# EAGLE design transfer-interconnect (EAGLE 7.6.0)

## Sheet 1 of 3
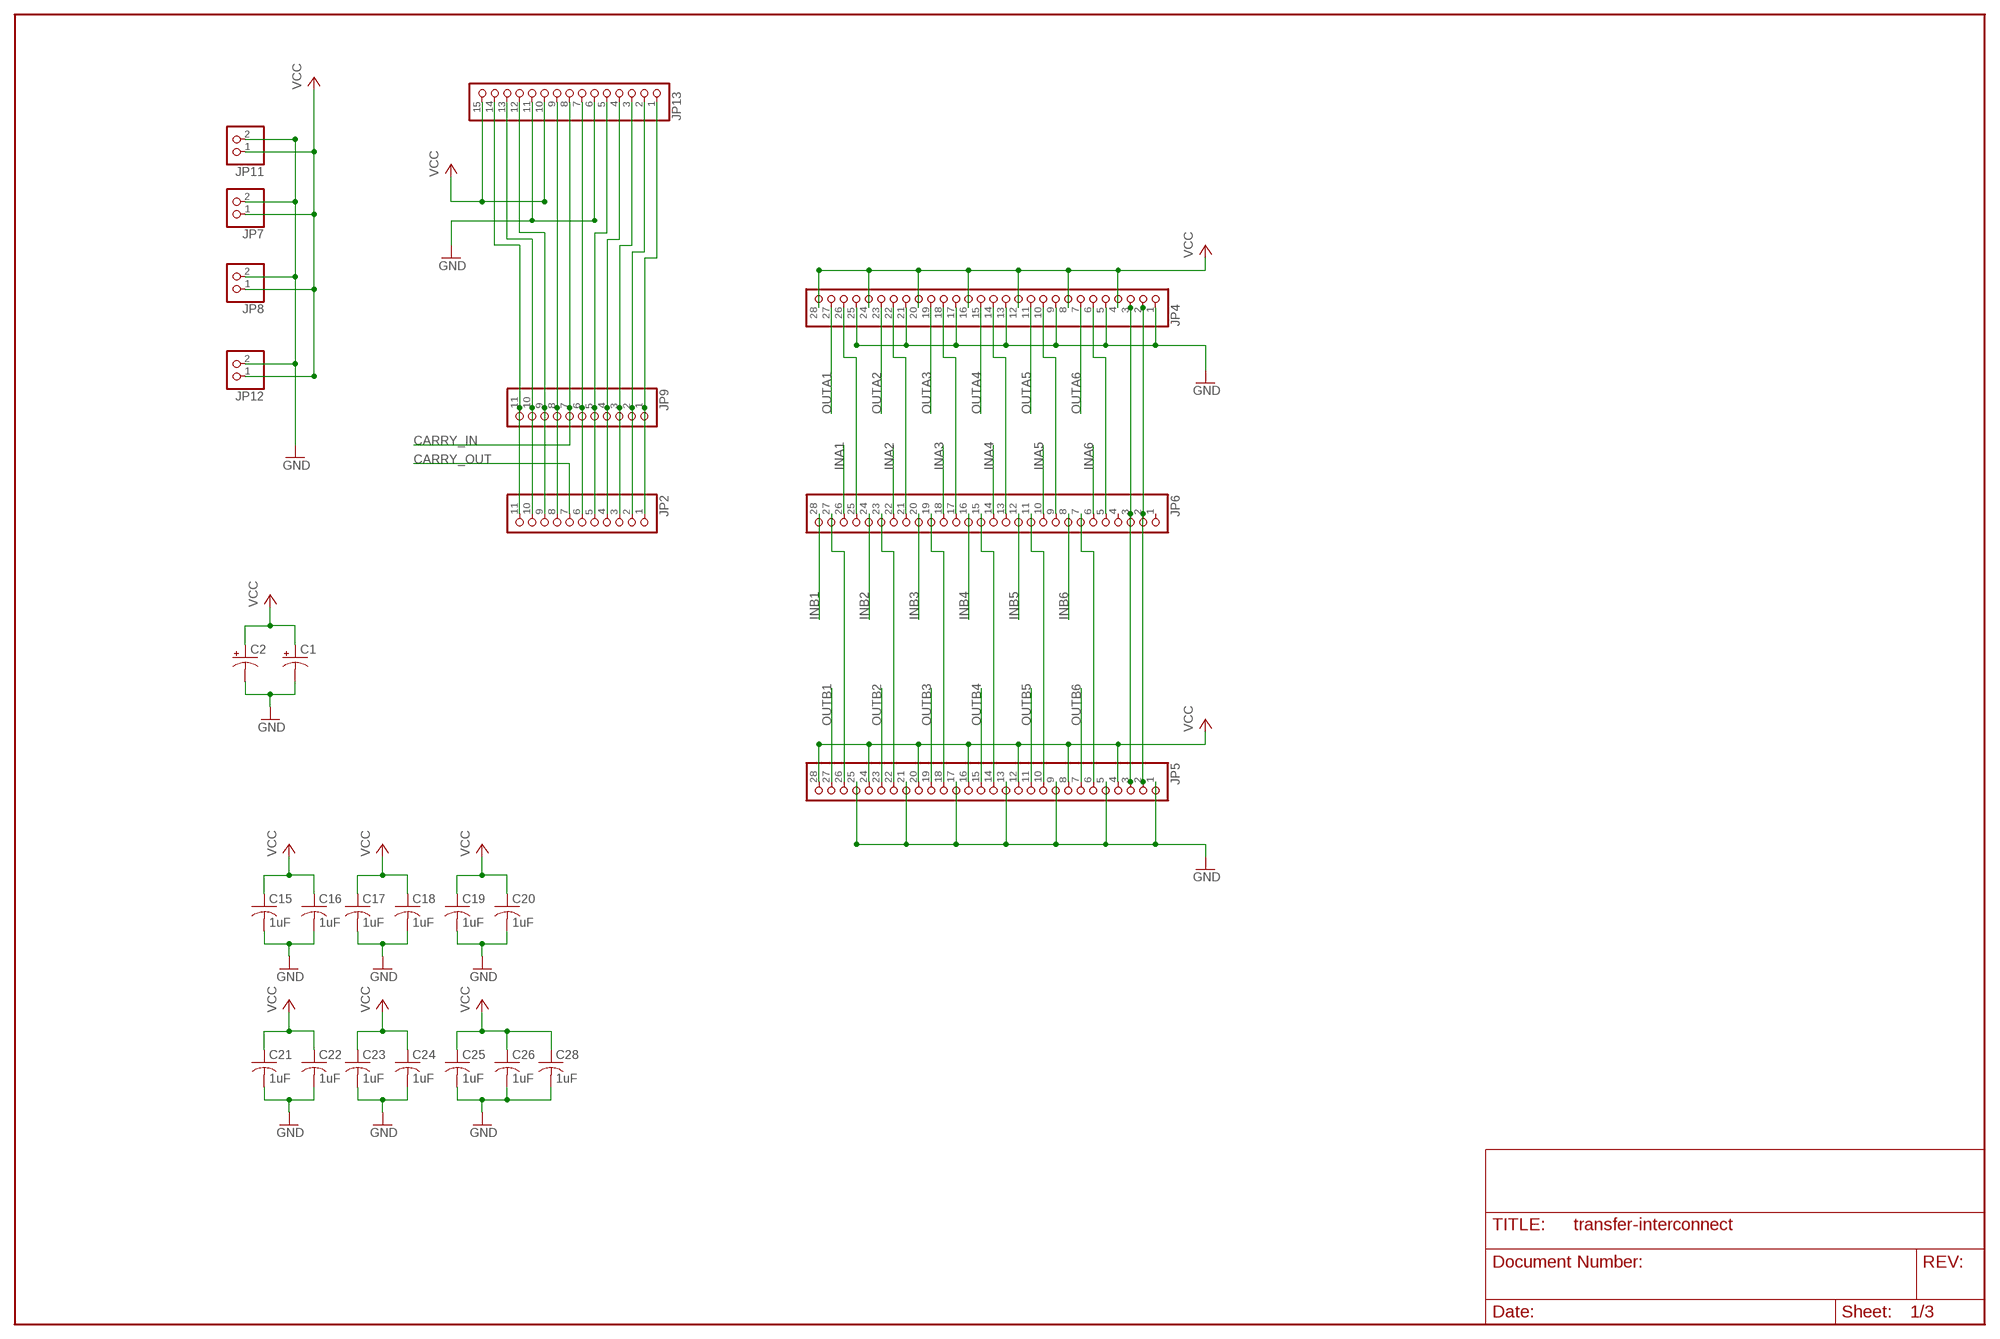
[diagram p0: schematic, sheet 1]

### Parts
C1  CPOL-USE15-6AXIAL  [E15-6]
C2  CPOL-USE15-6AXIAL  [E15-6]
C15  1uF  C-USC0603K  [C0603K]
C16  1uF  C-USC0603K  [C0603K]
C17  1uF  C-USC0603K  [C0603K]
C18  1uF  C-USC0603K  [C0603K]
C19  1uF  C-USC0603K  [C0603K]
C20  1uF  C-USC0603K  [C0603K]
C21  1uF  C-USC0603K  [C0603K]
C22  1uF  C-USC0603K  [C0603K]
C23  1uF  C-USC0603K  [C0603K]
C24  1uF  C-USC0603K  [C0603K]
C25  1uF  C-USC0603K  [C0603K]
C26  1uF  C-USC0603K  [C0603K]
C28  1uF  C-USC0603K  [C0603K]
JP2  PINHD-1X11  [1X11]
JP4  PINHD-1X28  [1X28]
JP5  PINHD-1X28  [1X28]
JP6  PINHD-1X28  [1X28]
JP7  PINHD-1X2  [1X02]
JP8  PINHD-1X2  [1X02]
JP9  PINHD-1X11  [1X11]
JP11  PINHD-1X2  [1X02]
JP12  PINHD-1X2  [1X02]
JP13  PINHD-1X15  [1X15]

### Nets
CARRY_IN: JP9.7 JP13.8 ; also sheet 3
CARRY_OUT: JP2.7 ; also sheet 3
GND: C1.- C2.- C15.2 C16.2 C17.2 C18.2 C19.2 C20.2 C21.2 C22.2 C23.2 C24.2 C25.2 C26.2 C28.2 JP4.1 JP4.5 JP4.9 JP4.13 JP4.17 JP4.21 JP4.25 JP5.1 JP5.5 JP5.9 JP5.13 JP5.17 JP5.21 JP5.25 JP7.2 JP8.2 JP11.2 JP12.2 JP13.6 JP13.11 ; also sheet 2,3
INA1: JP6.26 ; also sheet 2
INA2: JP6.22 ; also sheet 2
INA3: JP6.18 ; also sheet 2
INA4: JP6.14 ; also sheet 2
INA5: JP6.10 ; also sheet 2
INA6: JP6.6 ; also sheet 2
INB1: JP6.28 ; also sheet 3
INB2: JP6.24 ; also sheet 3
INB3: JP6.20 ; also sheet 3
INB4: JP6.16 ; also sheet 3
INB5: JP6.12 ; also sheet 3
INB6: JP6.8 ; also sheet 3
N$1: JP4.3 JP5.3 JP6.3
N$2: JP4.2 JP5.2 JP6.2
N$3: JP4.10 JP6.9
N$4: JP2.8 JP9.8 JP13.9
N$5: JP4.6 JP6.5
N$7: JP4.14 JP6.13
N$8: JP2.6 JP9.6 JP13.7
N$9: JP4.18 JP6.17
N$11: JP4.22 JP6.21
N$13: JP4.26 JP6.25
N$15: JP5.6 JP6.7
N$17: JP5.10 JP6.11
N$19: JP5.14 JP6.15
N$21: JP5.18 JP6.19
N$23: JP5.22 JP6.23
N$25: JP5.26 JP6.27
N$32: JP2.11 JP9.11 JP13.14
N$33: JP2.10 JP9.10 JP13.13
N$34: JP2.9 JP9.9 JP13.12
N$38: JP2.5 JP9.5 JP13.5
N$39: JP2.4 JP9.4 JP13.4
N$40: JP2.3 JP9.3 JP13.3
N$41: JP2.2 JP9.2 JP13.2
N$46: JP2.1 JP9.1 JP13.1
OUTA1: JP4.27 ; also sheet 2
OUTA2: JP4.23 ; also sheet 2
OUTA3: JP4.19 ; also sheet 2
OUTA4: JP4.15 ; also sheet 2
OUTA5: JP4.11 ; also sheet 2
OUTA6: JP4.7 ; also sheet 2
OUTB1: JP5.27 ; also sheet 3
OUTB2: JP5.23 ; also sheet 3
OUTB3: JP5.19 ; also sheet 3
OUTB4: JP5.15 ; also sheet 3
OUTB5: JP5.11 ; also sheet 3
OUTB6: JP5.7 ; also sheet 3
VCC: C1.+ C2.+ C15.1 C16.1 C17.1 C18.1 C19.1 C20.1 C21.1 C22.1 C23.1 C24.1 C25.1 C26.1 C28.1 JP4.4 JP4.8 JP4.12 JP4.16 JP4.20 JP4.24 JP4.28 JP5.4 JP5.8 JP5.12 JP5.16 JP5.20 JP5.24 JP5.28 JP7.1 JP8.1 JP11.1 JP12.1 JP13.10 JP13.15 ; also sheet 2,3
Unconnected: JP6.1 JP6.4

## Sheet 2 of 3
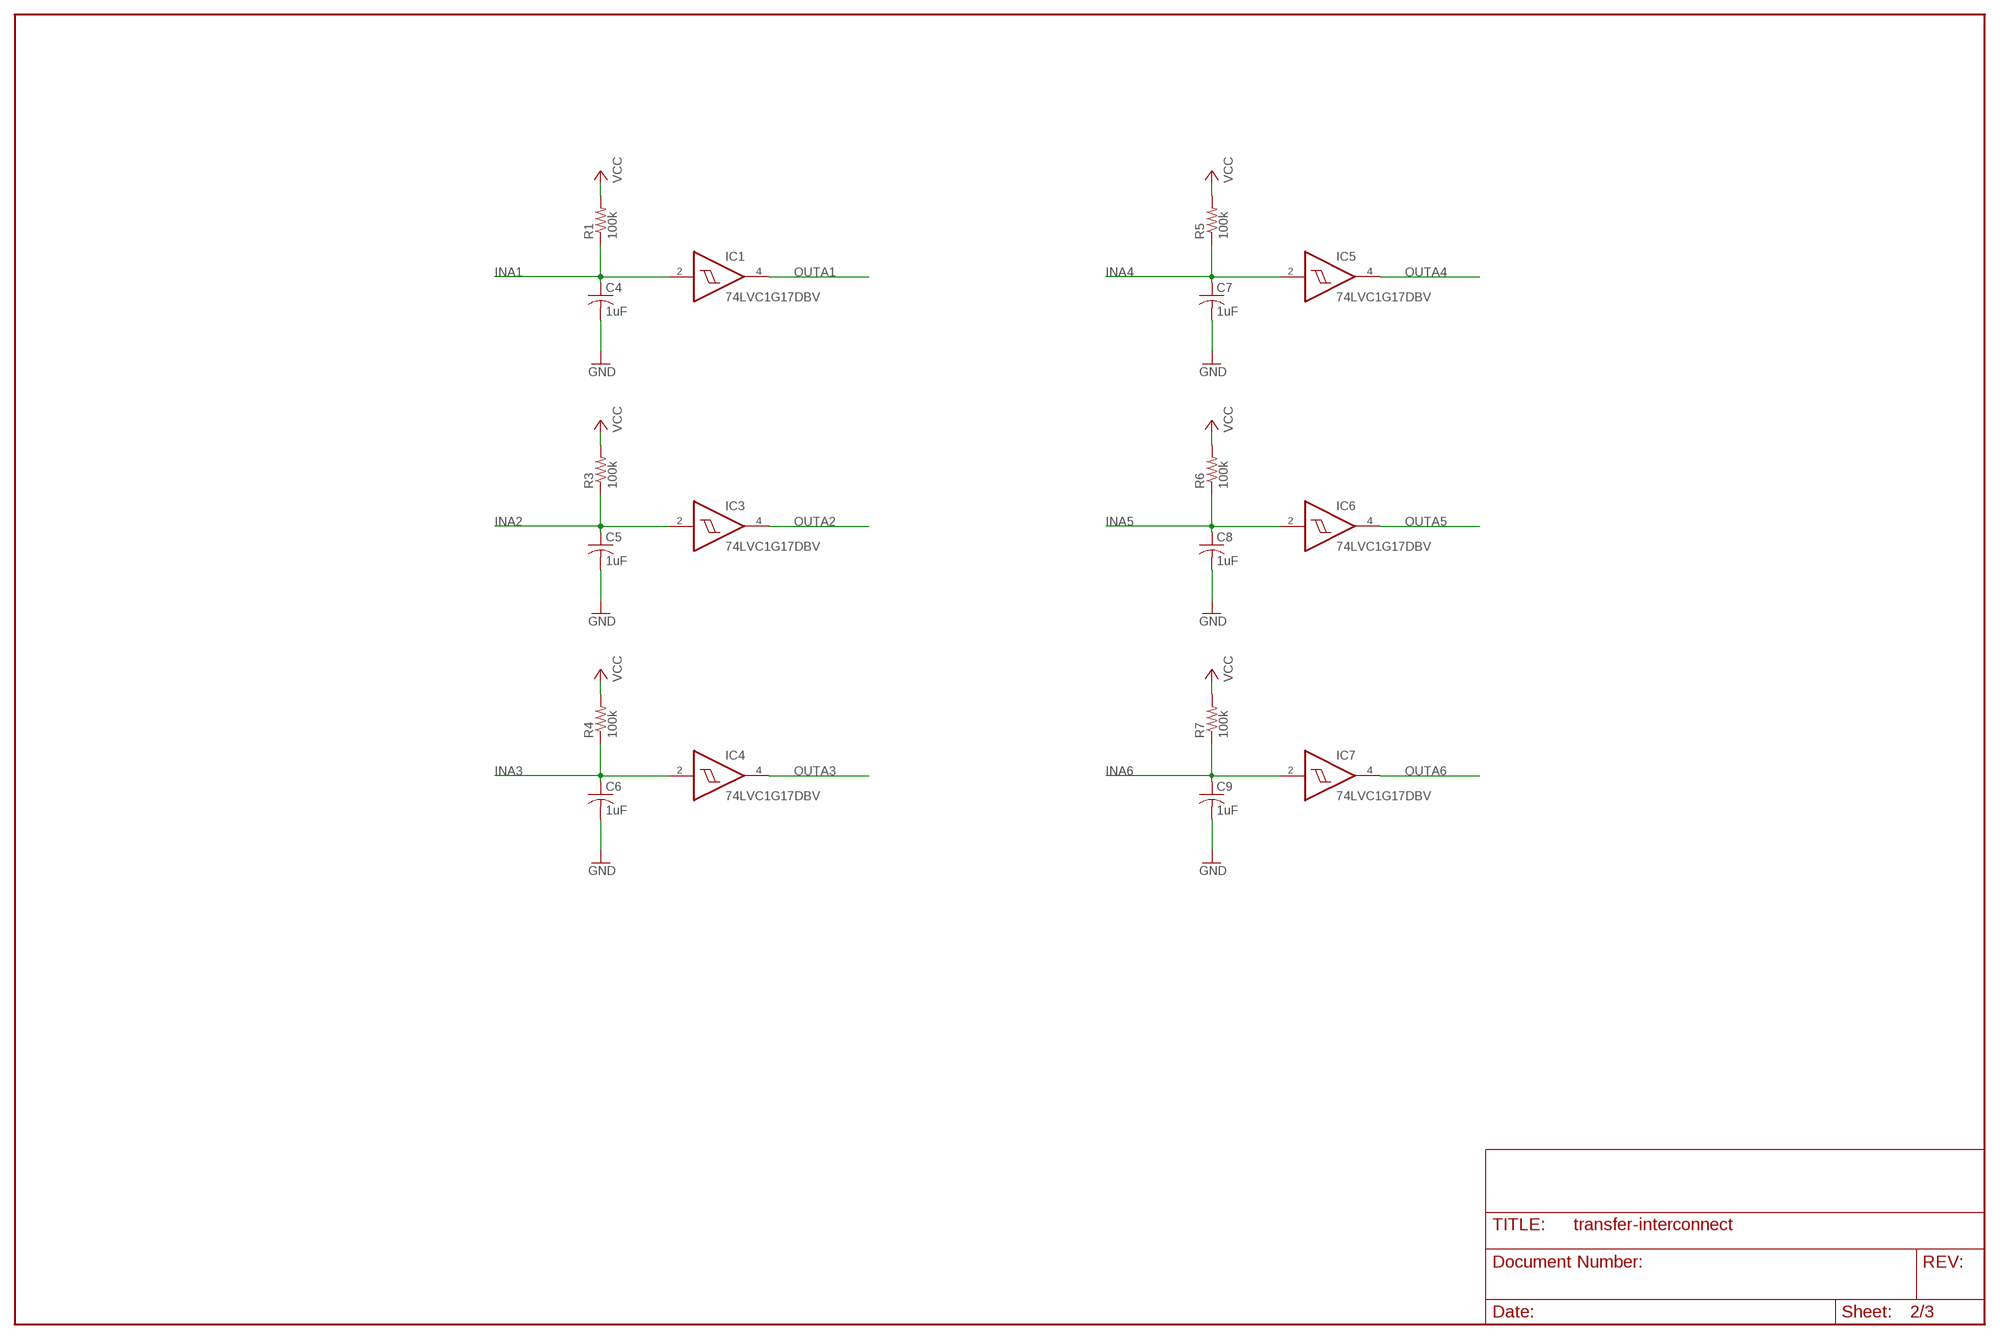
[diagram p1: schematic, sheet 2]

### Parts
C4  1uF  C-USC0603K  [C0603K]
C5  1uF  C-USC0603K  [C0603K]
C6  1uF  C-USC0603K  [C0603K]
C7  1uF  C-USC0603K  [C0603K]
C8  1uF  C-USC0603K  [C0603K]
C9  1uF  C-USC0603K  [C0603K]
IC1  74LVC1G17DBV  [SOT23-5]
IC3  74LVC1G17DBV  [SOT23-5]
IC4  74LVC1G17DBV  [SOT23-5]
IC5  74LVC1G17DBV  [SOT23-5]
IC6  74LVC1G17DBV  [SOT23-5]
IC7  74LVC1G17DBV  [SOT23-5]
R1  100k  R-US_R0603  [R0603]
R3  100k  R-US_R0603  [R0603]
R4  100k  R-US_R0603  [R0603]
R5  100k  R-US_R0603  [R0603]
R6  100k  R-US_R0603  [R0603]
R7  100k  R-US_R0603  [R0603]

### Nets
GND: C4.2 C5.2 C6.2 C7.2 C8.2 C9.2 ; also sheet 1,3
INA1: C4.1 IC1.2(I) R1.1 ; also sheet 1
INA2: C5.1 IC3.2(I) R3.1 ; also sheet 1
INA3: C6.1 IC4.2(I) R4.1 ; also sheet 1
INA4: C7.1 IC5.2(I) R5.1 ; also sheet 1
INA5: C8.1 IC6.2(I) R6.1 ; also sheet 1
INA6: C9.1 IC7.2(I) R7.1 ; also sheet 1
OUTA1: IC1.4(O) ; also sheet 1
OUTA2: IC3.4(O) ; also sheet 1
OUTA3: IC4.4(O) ; also sheet 1
OUTA4: IC5.4(O) ; also sheet 1
OUTA5: IC6.4(O) ; also sheet 1
OUTA6: IC7.4(O) ; also sheet 1
VCC: R1.2 R3.2 R4.2 R5.2 R6.2 R7.2 ; also sheet 1,3

## Sheet 3 of 3
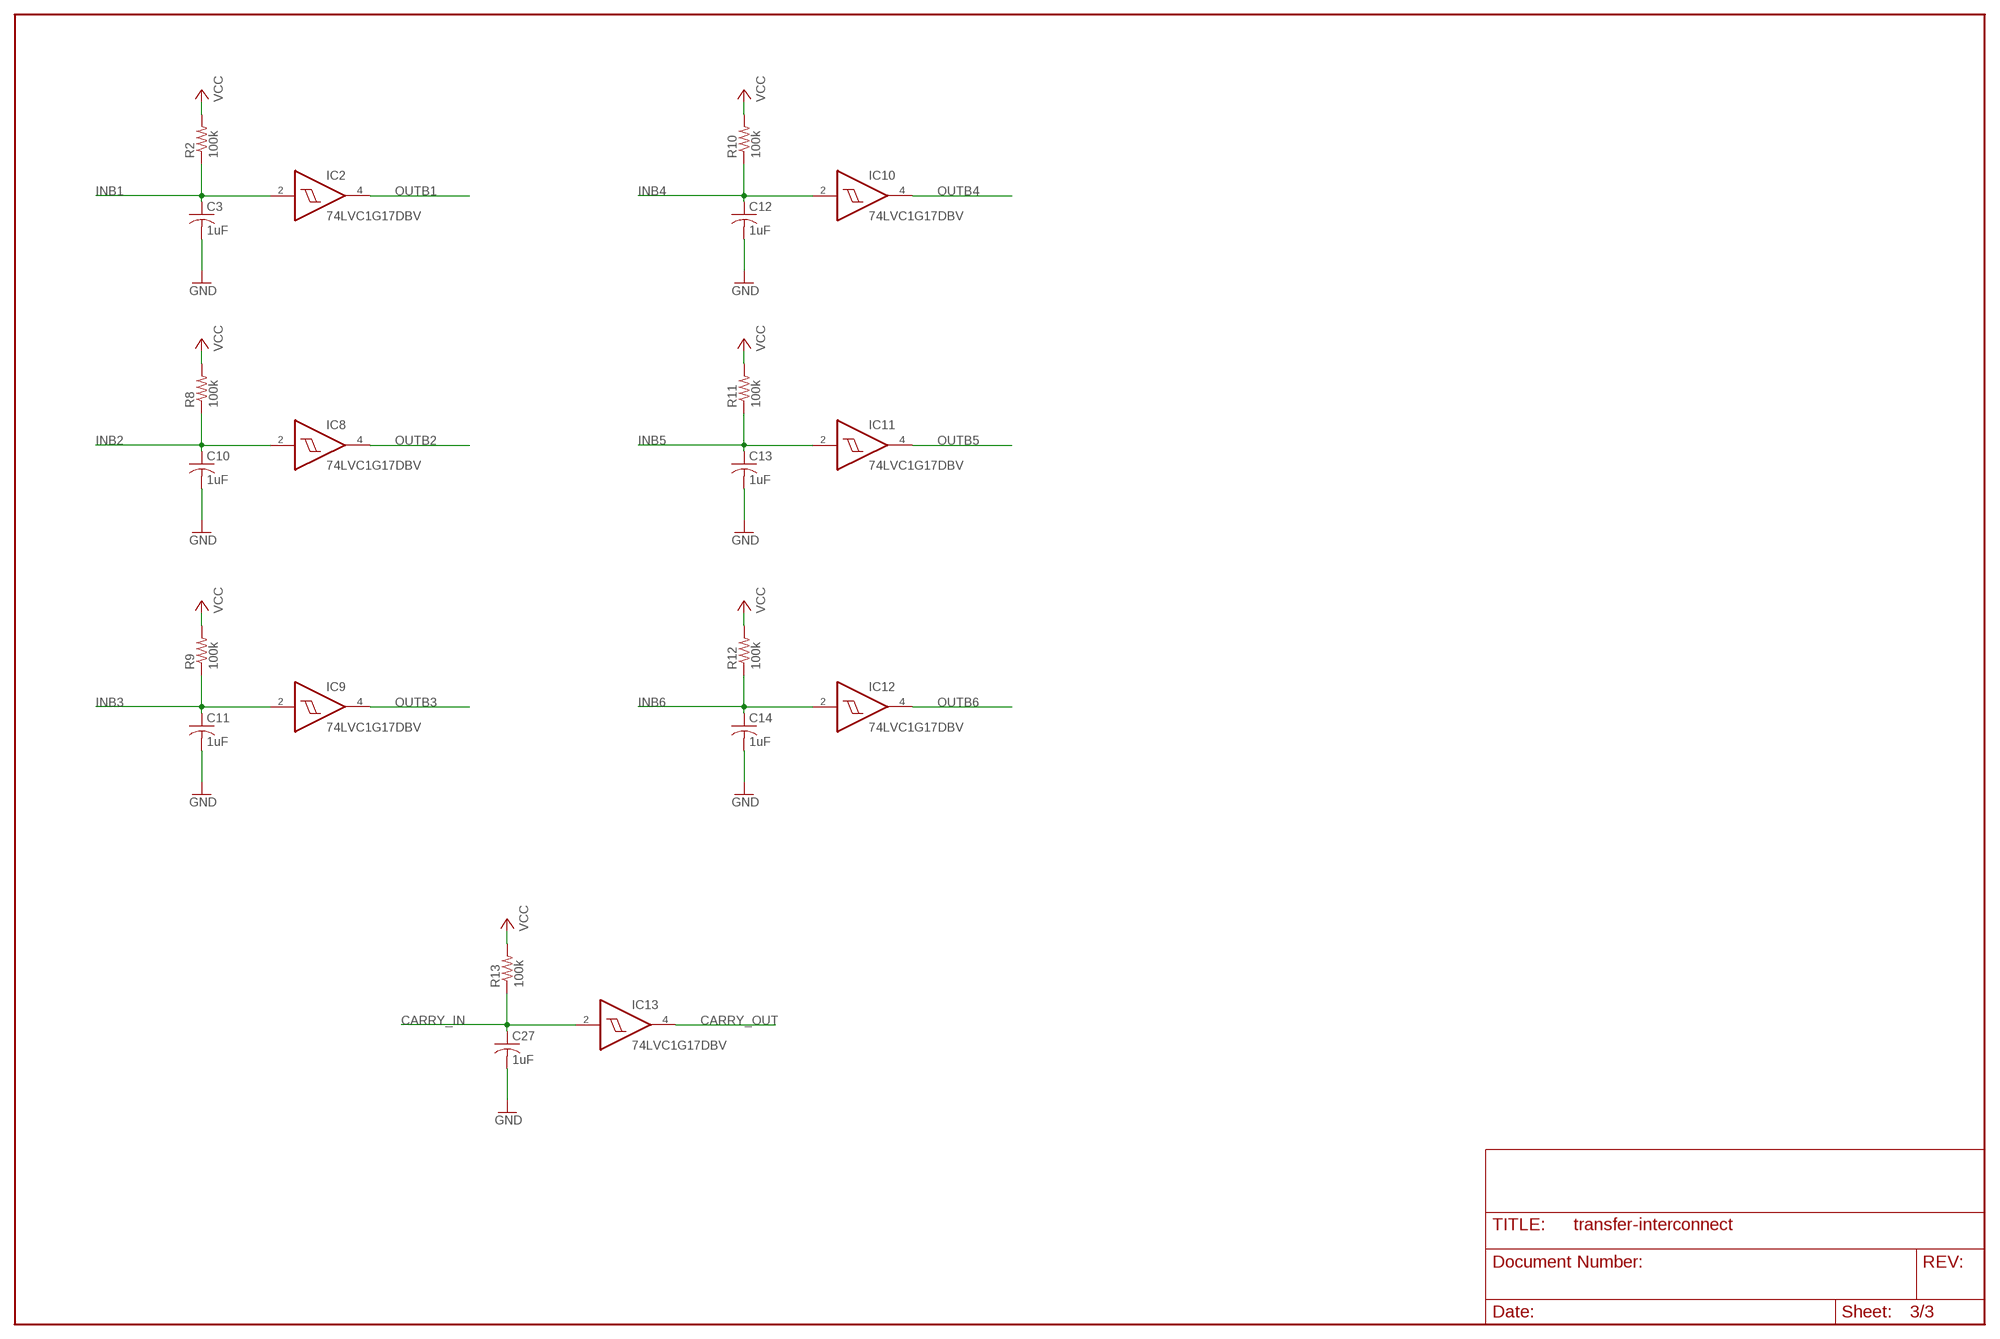
[diagram p2: schematic, sheet 3]

### Parts
C3  1uF  C-USC0603K  [C0603K]
C10  1uF  C-USC0603K  [C0603K]
C11  1uF  C-USC0603K  [C0603K]
C12  1uF  C-USC0603K  [C0603K]
C13  1uF  C-USC0603K  [C0603K]
C14  1uF  C-USC0603K  [C0603K]
C27  1uF  C-USC0603K  [C0603K]
IC2  74LVC1G17DBV  [SOT23-5]
IC8  74LVC1G17DBV  [SOT23-5]
IC9  74LVC1G17DBV  [SOT23-5]
IC10  74LVC1G17DBV  [SOT23-5]
IC11  74LVC1G17DBV  [SOT23-5]
IC12  74LVC1G17DBV  [SOT23-5]
IC13  74LVC1G17DBV  [SOT23-5]
R2  100k  R-US_R0603  [R0603]
R8  100k  R-US_R0603  [R0603]
R9  100k  R-US_R0603  [R0603]
R10  100k  R-US_R0603  [R0603]
R11  100k  R-US_R0603  [R0603]
R12  100k  R-US_R0603  [R0603]
R13  100k  R-US_R0603  [R0603]

### Nets
CARRY_IN: C27.1 IC13.2(I) R13.1 ; also sheet 1
CARRY_OUT: IC13.4(O) ; also sheet 1
GND: C3.2 C10.2 C11.2 C12.2 C13.2 C14.2 C27.2 ; also sheet 1,2
INB1: C3.1 IC2.2(I) R2.1 ; also sheet 1
INB2: C10.1 IC8.2(I) R8.1 ; also sheet 1
INB3: C11.1 IC9.2(I) R9.1 ; also sheet 1
INB4: C12.1 IC10.2(I) R10.1 ; also sheet 1
INB5: C13.1 IC11.2(I) R11.1 ; also sheet 1
INB6: C14.1 IC12.2(I) R12.1 ; also sheet 1
OUTB1: IC2.4(O) ; also sheet 1
OUTB2: IC8.4(O) ; also sheet 1
OUTB3: IC9.4(O) ; also sheet 1
OUTB4: IC10.4(O) ; also sheet 1
OUTB5: IC11.4(O) ; also sheet 1
OUTB6: IC12.4(O) ; also sheet 1
VCC: R2.2 R8.2 R9.2 R10.2 R11.2 R12.2 R13.2 ; also sheet 1,2

## Power pins joined to a net without a drawn wire
GND: IC1.3(GND) IC2.3(GND) IC3.3(GND) IC4.3(GND) IC5.3(GND) IC6.3(GND) IC7.3(GND) IC8.3(GND) IC9.3(GND) IC10.3(GND) IC11.3(GND) IC12.3(GND) IC13.3(GND)
VCC: IC1.5(VCC) IC2.5(VCC) IC3.5(VCC) IC4.5(VCC) IC5.5(VCC) IC6.5(VCC) IC7.5(VCC) IC8.5(VCC) IC9.5(VCC) IC10.5(VCC) IC11.5(VCC) IC12.5(VCC) IC13.5(VCC)

## Library data of the parts
C1 C2 = resistor:CPOL-US: POLARIZED CAPACITOR, American symbol
C3-C28 = resistor:C-US: CAPACITOR, American symbol
IC1-IC13 = 74xx-little-us:74*1G17: Single Schmitt-Trigger Buffer
JP2 JP9 = pinhead:PINHD-1X11: PIN HEADER
JP4-JP6 = pinhead:PINHD-1X28: PIN HEADER
JP7 JP8 JP11 JP12 = pinhead:PINHD-1X2: PIN HEADER
JP13 = pinhead:PINHD-1X15: PIN HEADER
R1-R13 = resistor:R-US_: RESISTOR, American symbol

## Board
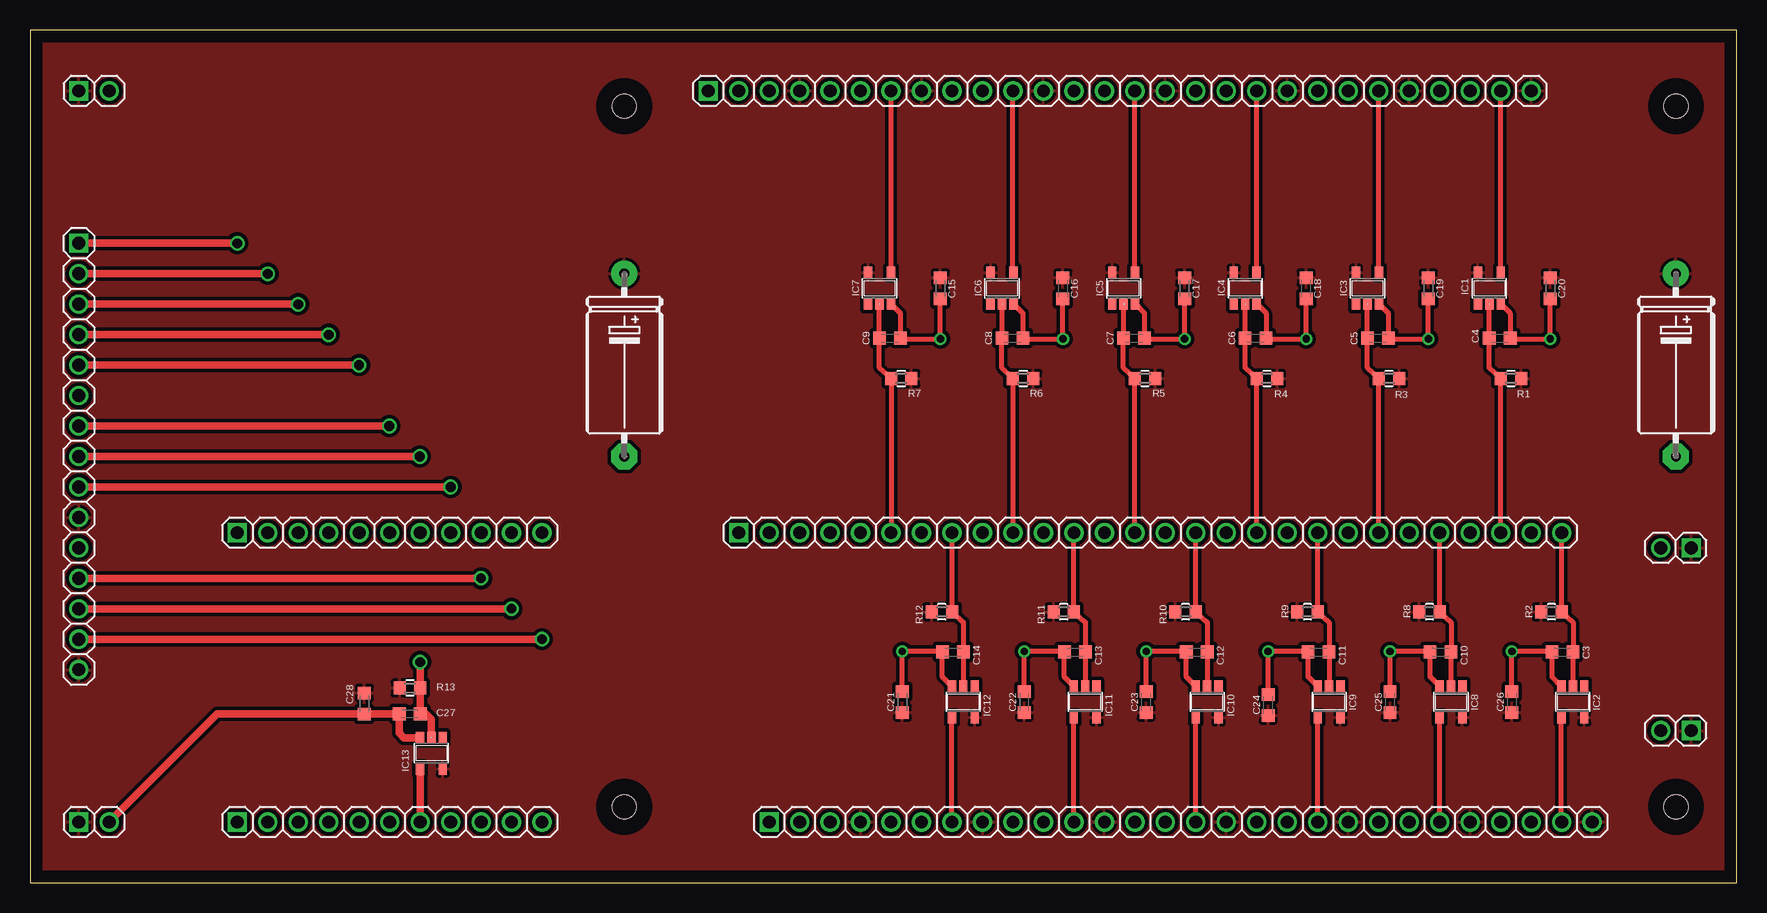
[diagram p3: board, top side]
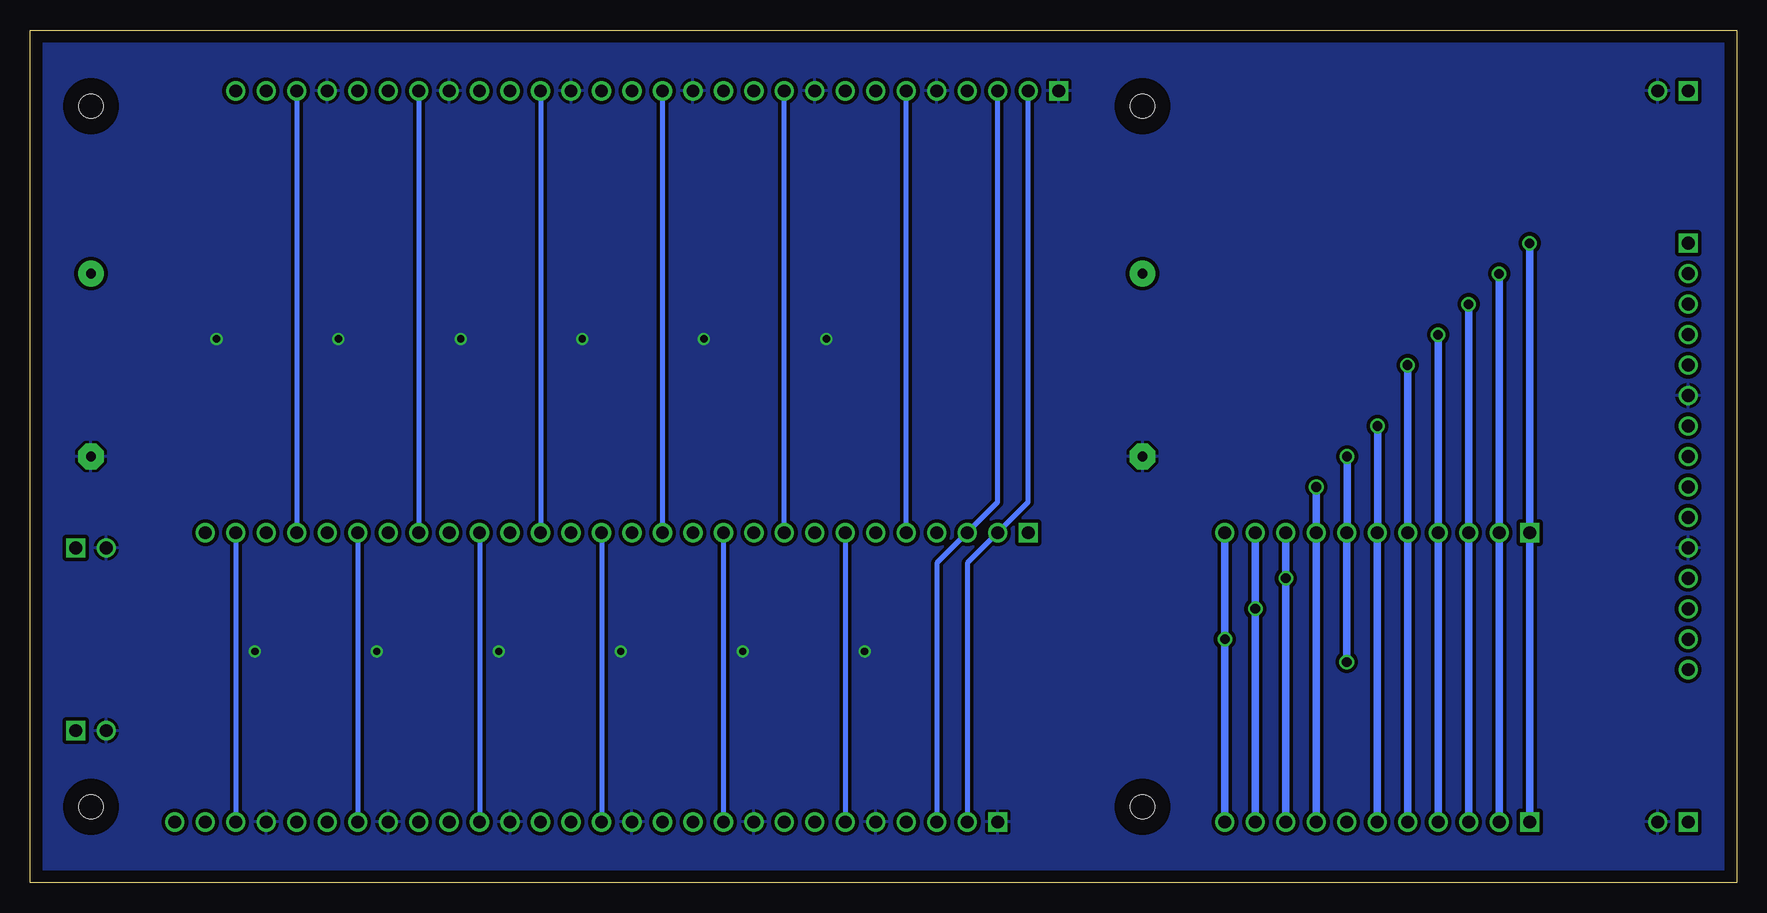
[diagram p4: board, bottom side, seen from below]

Size 142.24 x 71.12 mm. Coordinates in mm from the lower left corner, seen from the top.
Outline: 0,0 142.24,0 142.24,71.12 0,71.12 0,0
Copper layers (1*16): Top 0.035mm / dielectric 1.5mm / Bottom 0.035mm
Design rules "default *": minimum track width 10mil, minimum drill 12mil, track to track 8mil, track to pad 8mil, pad to pad 8mil, via to via 8mil, smd to smd 8mil, copper to edge 40mil, drill to drill 8mil, minimum pad ring 10mil, minimum via ring 8mil, stop-mask expansion 4mil, vias tented up to drill 0mil, thermal gap 10mil
Holes 2.01 mm at 49.53,64.77 137.16,64.77 49.53,6.35 137.16,6.35
tRestrict: area 47.5,62.8 to 51.5,66.8; area 135.2,62.8 to 139.2,66.8; area 47.5,4.3 to 51.5,8.4; area 135.2,4.3 to 139.2,8.4
bRestrict: area 47.5,62.8 to 51.5,66.8; area 135.2,62.8 to 139.2,66.8; area 47.5,4.3 to 51.5,8.4; area 135.2,4.3 to 139.2,8.4

### Footprints (pad centres in the part's own frame; a part is rotated, then mirrored left to right if it is on the bottom)
E15-6 = drill 0.813 pad 2.159: + -7.62,0 | drill 0.813 pad 2.159 octagon: - 7.62,0
C0603K = smd 1.05 x 1.08: 1 -0.875,0; 2 0.875,0
SOT23-5 = smd 0.69 x 0.99: 1 -0.95,-1.29; 2 0,-1.29; 3 0.95,-1.29; 4 0.95,1.3; 5 -0.95,1.3
1X11 = drill 1.067 square: 1 -12.7,0 | drill 1.067: 2 -10.16,0; 3 -7.62,0; 4 -5.08,0; 5 -2.54,0; 6 0,0; 7 2.54,0; 8 5.08,0; 9 7.62,0; 10 10.16,0; 11 12.7,0
1X28 = drill 1.067 square: 1 -34.29,0 | drill 1.067: 2 -31.75,0; 3 -29.21,0; 4 -26.67,0; 5 -24.13,0; 6 -21.59,0; 7 -19.05,0; 8 -16.51,0; 9 -13.97,0; 10 -11.43,0; 11 -8.89,0; 12 -6.35,0; 13 -3.81,0; 14 -1.27,0; 15 1.27,0; 16 3.81,0; 17 6.35,0; 18 8.89,0; 19 11.43,0; 20 13.97,0; 21 16.51,0; 22 19.05,0; 23 21.59,0; 24 24.13,0; 25 26.67,0; 26 29.21,0; 27 31.75,0; 28 34.29,0
1X02 = drill 1.067 square: 1 -1.27,0 | drill 1.067: 2 1.27,0
1X15 = drill 1.067 square: 1 -17.78,0 | drill 1.067: 2 -15.24,0; 3 -12.7,0; 4 -10.16,0; 5 -7.62,0; 6 -5.08,0; 7 -2.54,0; 8 0,0; 9 2.54,0; 10 5.08,0; 11 7.62,0; 12 10.16,0; 13 12.7,0; 14 15.24,0; 15 17.78,0
R0603 = smd 1 x 1.1: 1 -0.85,0; 2 0.85,0

### Placement (x,y rotation side)
C1  49.53,43.18 270 top
C2  137.16,43.18 270 top
C3  127.71,19.25 180 top
C4  122.48,45.42 0 top
C5  112.32,45.42 0 top
C6  102.13,45.42 0 top
C7  92,45.42 0 top
C8  81.86,45.42 0 top
C9  71.65,45.42 0 top
C10  117.55,19.25 180 top
C11  107.39,19.25 180 top
C12  97.23,19.25 180 top
C13  87.07,19.25 180 top
C14  76.91,19.25 180 top
C15  75.87,49.58 270 top
C16  86.08,49.58 270 top
C17  96.22,49.58 270 top
C18  106.35,49.58 270 top
C19  116.54,49.58 270 top
C20  126.7,49.58 270 top
C21  72.69,15.09 90 top
C22  82.85,15.09 90 top
C23  93.01,15.09 90 top
C24  103.17,14.83 90 top
C25  113.33,15.09 90 top
C26  123.49,15.09 90 top
C27  31.65,14.1 180 top
C28  27.86,14.96 270 top
IC1  121.62,49.58 0 top
IC2  128.57,15.09 180 top
IC3  111.46,49.58 0 top
IC4  101.27,49.58 0 top
IC5  91.14,49.58 0 top
IC6  81,49.58 0 top
IC7  70.79,49.58 0 top
IC8  118.41,15.09 180 top
IC9  108.25,15.09 180 top
IC10  98.09,15.09 180 top
IC11  87.93,15.09 180 top
IC12  77.77,15.09 180 top
IC13  33.45,10.82 180 top
JP2  29.97,5.08 0 top
JP4  90.81,66.04 0 top
JP5  95.89,5.08 0 top
JP6  93.34,29.21 0 top
JP7  137.16,12.7 180 top
JP8  137.16,27.94 180 top
JP9  29.97,29.21 0 top
JP11  5.33,5.08 0 top
JP12  5.33,66.04 0 top
JP13  4.06,35.56 270 top
R1  123.41,42.06 0 top
R2  126.78,22.61 180 top
R3  113.25,42.06 0 top
R4  103.09,42.06 0 top
R5  92.93,42.06 0 top
R6  82.77,42.06 0 top
R7  72.61,42.06 0 top
R8  116.62,22.61 180 top
R9  106.46,22.61 180 top
R10  96.3,22.61 180 top
R11  86.14,22.61 180 top
R12  75.98,22.61 180 top
R13  31.66,16.26 180 top

### Tracks (layer width: path | path; a pad name or v marks a point on that pad's centre or on a via)
CARRY_IN  (via drill 0.81)
  Top 0.61: JP13.8 v32.49,35.56 | v32.51,18.41 32.51,16 R13.1 C27.1 32.99,14.1 33.45,13.64 IC13.2
  Bottom 0.61: v32.49,35.56 32.49,29.23 JP9.7 v32.51,18.41
CARRY_OUT
  Top 0.61: IC13.4 JP2.7
GND  (via drill 0.6)
  Top 0.254: C4.2 123.41,45.36 | C5.2 113.25,45.36 | C6.2 103.06,45.36 | C7.2 92.92,45.36 | C8.2 82.79,45.36 | C9.2 72.58,45.36 | C3.2 126.78,19.3 | C10.2 116.62,19.3 | C11.2 106.47,19.3 | C12.2 96.31,19.3 | C13.2 86.14,19.3 | C14.2 75.98,19.3
  Top 0.406: IC1.3 123.35,47.5 C4.2 | 123.41,45.36 v126.69,45.36 C20.2 | IC3.3 113.19,47.5 C5.2 | 113.25,45.36 v116.53,45.36 C19.2 | IC4.3 103.01,47.5 C6.2 | 103.06,45.36 v106.35,45.36 C18.2 | IC5.3 92.87,47.5 C7.2 | 92.92,45.36 v96.22,45.36 C17.2 | IC6.3 82.74,47.5 C8.2 | 82.79,45.36 v86.08,45.36 C16.2 | IC7.3 72.53,47.5 C9.2 | 72.58,45.36 v75.87,45.36 C15.2 | IC2.3 126.84,17.17 C3.2 | 126.78,19.3 v123.5,19.3 C26.2 | IC8.3 116.68,17.17 C10.2 | 116.62,19.3 v113.33,19.3 C25.2 | IC9.3 106.52,17.17 C11.2 | 106.47,19.3 v103.17,19.3 C24.2 | IC10.3 96.36,17.17 C12.2 | 96.31,19.3 v93.02,19.3 C23.2 | IC11.3 86.2,17.17 C13.2 | 86.14,19.3 v82.86,19.3 C22.2 | IC12.3 76.04,17.17 C14.2 | 75.98,19.3 v72.69,19.3 C21.2
  Top 0.61: IC13.3 31.15,12.11 30.76,12.5 30.76,14.08 C27.2 27.88,14.1 C28.2 15.61,14.09 JP11.2
  pour Bottom (isolate 0.305): 0,0 142.24,0 142.24,71.12 0,71.12
INA1
  Top 0.254: C4.1 121.61,45.43 | JP6.26
  Top 0.406: C4.1 121.6,42.94 R1.1 JP6.26 | 121.61,45.43 IC1.2
INA2
  Top 0.254: C5.1 111.45,45.43 | JP6.22
  Top 0.406: C5.1 111.44,42.94 R3.1 JP6.22 | 111.45,45.43 IC3.2
INA3
  Top 0.254: C6.1 | JP6.18
  Top 0.406: C6.1 101.26,42.94 R4.1 JP6.18 | C6.1 IC4.2
INA4
  Top 0.254: C7.1 91.14,45.43 | JP6.14
  Top 0.406: C7.1 91.12,42.94 R5.1 JP6.14 | 91.14,45.43 IC5.2
INA5
  Top 0.254: C8.1 81,45.43
  Top 0.406: C8.1 80.99,42.94 R6.1 JP6.10 | 81,45.43 IC6.2
INA6
  Top 0.254: C9.1
  Top 0.406: C9.1 70.78,42.94 R7.1 JP6.6 | C9.1 IC7.2
INB1
  Top 0.254: C3.1 128.57,19.24
  Top 0.406: C3.1 128.59,21.73 R2.1 JP6.28 | 128.57,19.24 IC2.2
INB2
  Top 0.254: C10.1 118.42,19.24
  Top 0.406: C10.1 118.43,21.73 R8.1 JP6.24 | 118.42,19.24 IC8.2
INB3
  Top 0.254: C11.1 108.25,19.24
  Top 0.406: C11.1 108.27,21.73 R9.1 JP6.20 | 108.25,19.24 IC9.2
INB4
  Top 0.254: C12.1 98.09,19.24
  Top 0.406: C12.1 98.11,21.73 R10.1 JP6.16 | 98.09,19.24 IC10.2
INB5
  Top 0.254: C13.1 87.94,19.24
  Top 0.406: C13.1 87.95,21.73 R11.1 JP6.12 | 87.94,19.24 IC11.2
INB6
  Top 0.254: C14.1 77.78,19.24
  Top 0.406: C14.1 77.79,21.73 R12.1 JP6.8 | 77.78,19.24 IC12.2
N$1
  Bottom 0.406: JP5.3 66.67,26.67 JP6.3 61.59,31.75 JP4.3
N$2
  Bottom 0.406: JP5.2 64.14,26.67 JP6.2 59.05,31.75 JP4.2
N$3
  Bottom 0.406: JP6.9 JP4.10
N$4  (via drill 0.81)
  Top 0.61: JP13.9 v35.05,33.02
  Bottom 0.61: JP2.8 JP9.8 v35.05,33.02
N$5
  Bottom 0.406: JP6.5 JP4.6
N$7
  Bottom 0.406: JP4.14 JP6.13
N$8  (via drill 0.81)
  Top 0.61: JP13.7 v29.95,38.1
  Bottom 0.61: JP2.6 JP9.6 29.95,29.23 v29.95,38.1
N$9
  Bottom 0.406: JP4.18 JP6.17
N$11
  Bottom 0.406: JP4.22 JP6.21
N$13
  Bottom 0.406: JP4.26 JP6.25
N$15
  Bottom 0.406: JP6.7 JP5.6
N$17
  Bottom 0.406: JP6.11 JP5.10
N$19
  Bottom 0.406: JP6.15 JP5.14
N$21
  Bottom 0.406: JP6.19 JP5.18
N$23
  Bottom 0.406: JP6.23 JP5.22
N$25
  Bottom 0.406: JP6.27 JP5.26
N$32  (via drill 0.8)
  Top 0.61: JP13.14 v42.67,20.32
  Bottom 0.61: JP9.11 v42.67,20.32 JP2.11
N$33  (via drill 0.8)
  Top 0.61: JP13.13 v40.13,22.86
  Bottom 0.61: JP9.10 v40.13,22.86 JP2.10
N$34  (via drill 0.8)
  Top 0.61: JP13.12 v37.59,25.4
  Bottom 0.61: JP9.9 v37.59,25.4 JP2.9
N$38  (via drill 0.8)
  Top 0.61: JP13.5 v27.43,43.18
  Bottom 0.61: v27.43,43.18 JP9.5 JP2.5
N$39  (via drill 0.8)
  Top 0.61: JP13.4 v24.89,45.72
  Bottom 0.61: v24.89,45.72 JP9.4 JP2.4
N$40  (via drill 0.8)
  Top 0.61: JP13.3 v22.35,48.26
  Bottom 0.61: v22.35,48.26 JP9.3 JP2.3
N$41  (via drill 0.8)
  Top 0.61: JP13.2 v19.81,50.8
  Bottom 0.61: v19.81,50.8 JP9.2 JP2.2
N$46  (via drill 0.8)
  Top 0.61: JP13.1 v17.27,53.34
  Bottom 0.61: v17.27,53.34 JP9.1 JP2.1
OUTA1
  Top 0.406: IC1.4 122.56,50.88 JP4.27
OUTA2
  Top 0.254: IC3.4 112.39,50.88
  Top 0.406: 112.39,50.88 JP4.23
OUTA3
  Top 0.254: IC4.4 102.23,50.88
  Top 0.406: 102.23,50.88 JP4.19
OUTA4
  Top 0.254: IC5.4 92.08,50.88
  Top 0.406: 92.08,50.88 JP4.15
OUTA5
  Top 0.254: IC6.4 81.92,50.88
  Top 0.406: 81.92,50.88 JP4.11
OUTA6
  Top 0.254: IC7.4 71.75,50.88
  Top 0.406: 71.75,50.88 JP4.7
OUTB1
  Top 0.406: JP5.27 127.62,5.08 IC2.4
OUTB2
  Top 0.406: JP5.23 117.47,5.08 IC8.4
OUTB3
  Top 0.406: JP5.19 IC9.4
OUTB4
  Top 0.406: JP5.15 97.14,5.08 IC10.4
OUTB5
  Top 0.406: JP5.11 86.98,5.08 IC11.4
OUTB6
  Top 0.406: JP5.7 76.83,5.08 IC12.4
VCC
  pour Top (isolate 0.305): 0,0 142.24,0 142.24,71.12 0,71.12

### Text on the board
Document: + | - | http://www.witch-e.org | Transfer Interconnect Board | - | + | + | - | + | -